# EAGLE design presTimer (EAGLE 7.7.0)
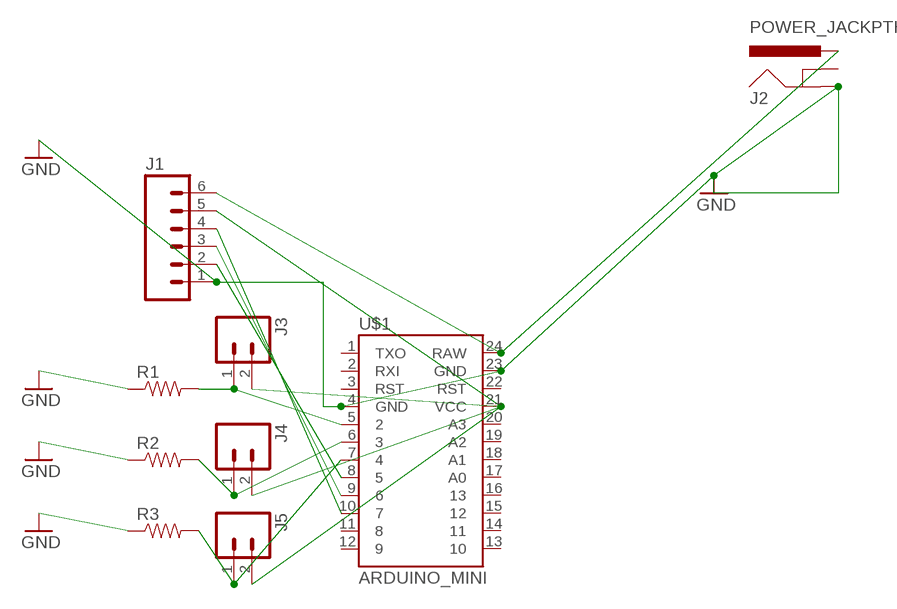
[diagram p0: schematic, sheet 1]

## Parts
J1  M06POLAR  [MOLEX-1X6]
J2  POWER_JACKPTH  [POWER_JACK_PTH]
J3  M02LOCK  [1X02_LOCK]
J4  M02LOCK  [1X02_LOCK]
J5  M02LOCK  [1X02_LOCK]
R1  RESISTORAXIAL-0.3  [AXIAL-0.3]
R2  RESISTORAXIAL-0.3  [AXIAL-0.3]
R3  RESISTORAXIAL-0.3  [AXIAL-0.3]
U$1  ARDUINO_MINI  [ARDUINO_MINI]

## Nets
GND: J1.1 J2.GND R1.P$1 R2.P$1 R3.P$1 U$1.4(GND) U$1.23(GND)
N$1: J1.2 U$1.8
N$2: J5.1 R3.P$2 U$1.7
N$3: J4.1 R2.P$2 U$1.6
N$4: J3.1 R1.P$2 U$1.5
N$5: J1.6 J2.PWR U$1.24(RAW)
N$6: J1.5 J3.2 J4.2 J5.2 U$1.21(VCC)
N$7: J1.3 U$1.9
N$8: J1.4 U$1.10
Unconnected: J2.GNDBREAK U$1.1(TXO) U$1.2(RXI) U$1.3(RST) U$1.11 U$1.12 U$1.13 U$1.14 U$1.15 U$1.16 U$1.17(A0) U$1.18(A1) U$1.19(A2) U$1.20(A3) U$1.22(RST)

## Library data of the parts
J1 = SparkFun-Connectors:M06: Header 6 Standard 6-pin 0.1" header. Use with straight break away headers (SKU : PRT-00116), right angle break away headers (PRT-00553), swiss pins (PRT-00743), machine pins (PRT-00117), and female headers (PRT-00115). Molex polarized connector foot print use with SKU : PRT-08094 with associated crimp pins and housings. NOTES ON THE VARIANTS LOCK and LOCK_LONGPADS... This footprint was designed to help hold the alignment of a through-hole component (i.e. 6-pin header) while soldering it into place. You may notice that each hole has been shifted either up or down by 0.005 of an inch from it's more standard position (which is a perfectly straight line). This slight alteration caused the pins (the squares in the middle) to touch the edges of the holes. Because they are alternating, it causes a "brace" to hold the component in place. 0.005 has proven to be the perfect amount of "off-center" position when using our standard breakaway headers. Although looks a little odd when you look at the bare footprint, once you have a header in there, the alteration is very hard to notice. Also,if you push a header all the way into place, it is covered up entirely on the bottom side. This idea of altering the position of holes to aid alignment will be further integrated into the Sparkfun Library for other footprints. It can help hold any component with 3 or more connection pins.
J2 = Spark:POWER_JACK: Power Jack This is the standard 5.5mm barrel jack for power. The PTH is the most common, proven, reliable, footprint. The Slot footprint only works if the mill layer is transmitted to the PCB fab house so be warned. Spark Fun Electronics SKU : PRT-00119 SMT: CONN-08106 Mating wall wart : TOL-00298 (and others)
J3-J5 = SparkFun-Connectors:M02: Standard 2-pin 0.1" header. Use with - straight break away headers ( PRT-00116) - right angle break away headers (PRT-00553) - swiss pins (PRT-00743) - machine pins (PRT-00117) - female headers (PRT-00115) Molex polarized connector foot print use with: PRT-08233 with associated crimp pins and housings. 2.54_SCREWTERM for use with PRT-10571. 3.5mm Screw Terminal footprints for PRT-08084 5mm Screw Terminal footprints for use with PRT-08432
R1-R3 = SparkFun-Passives:RESISTOR: Resistor Basic schematic elements and footprints for 0603, 1206, and PTH resistors.
U$1 = SparkFun-Boards:ARDUINO_MINI: Arduino Pro Mini footprint

## Board
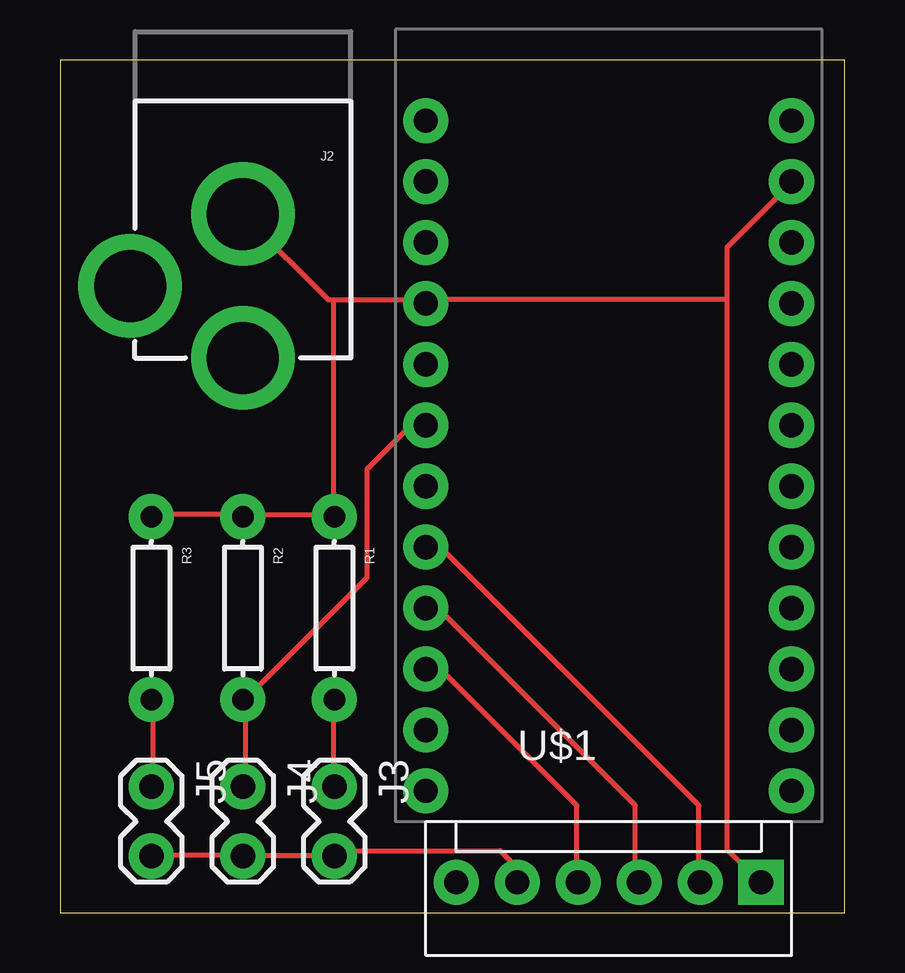
[diagram p1: board, top side]
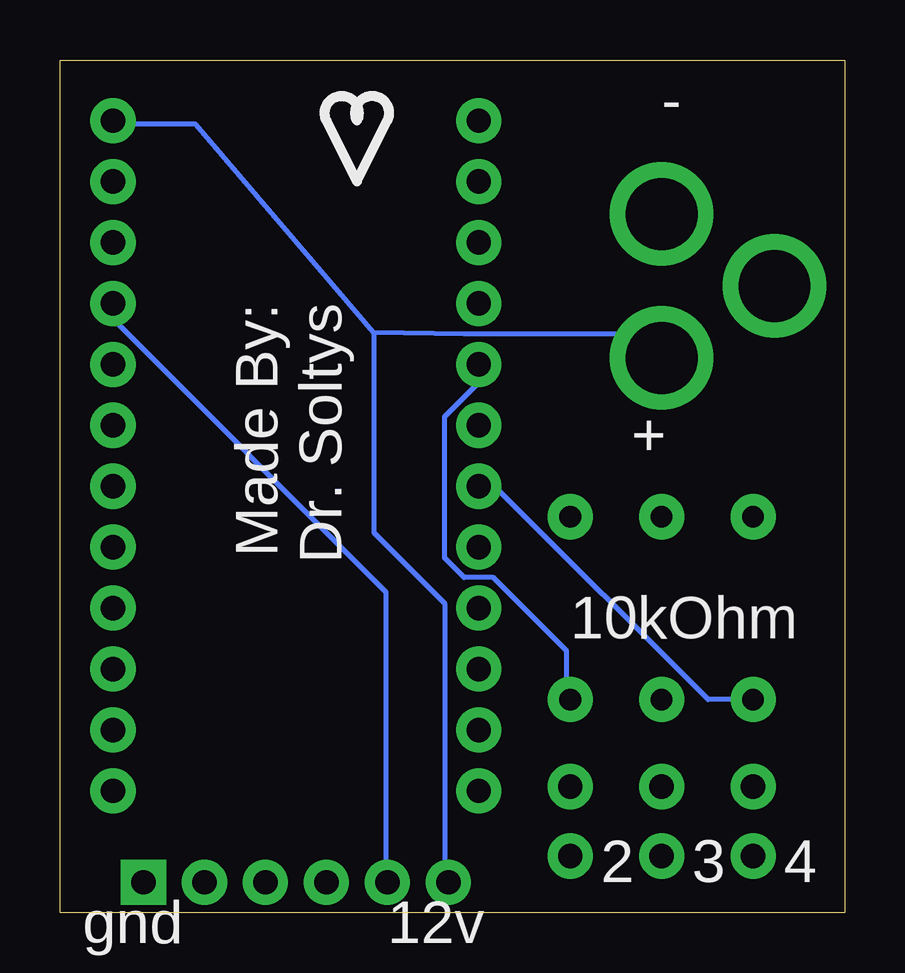
[diagram p2: board, bottom side, seen from below]

Size 32.69 x 35.55 mm. Coordinates in mm from the lower left corner, seen from the top.
Outline: 0,0 32.69,0 32.69,35.55 0,35.55 0,0
Copper layers (1*16): Top 0.035mm / dielectric 1.5mm / Bottom 0.035mm
Design rules "SparkFun": minimum track width 8mil, minimum drill 20mil, track to track 8mil, track to pad 8mil, pad to pad 8mil, via to via 8mil, smd to smd 8mil, copper to edge 8mil, drill to drill 8mil, minimum pad ring 12mil, minimum via ring 10mil, stop-mask expansion 4mil, vias tented up to drill 20mil, thermal gap 10mil

### Footprints (pad centres in the part's own frame; a part is rotated, then mirrored left to right if it is on the bottom)
MOLEX-1X6 = drill 1.016 pad 1.88 square: 1 0,0 | drill 1.016 pad 1.88: 2 2.54,0; 3 5.08,0; 4 7.62,0; 5 10.16,0; 6 12.7,0
POWER_JACK_PTH = drill 2.997 pad 4.318: GND 0,7.7; GNDBREAK 4.7,10.7; PWR 0,13.7
1X02_LOCK = drill 1.016 pad 1.88: 1 -0.178,0; 2 2.718,0
AXIAL-0.3 = drill 0.9 pad 1.88: P$1 -3.81,0; P$2 3.81,0
ARDUINO_MINI = drill 1.016 pad 1.88: 1 -7.62,12.7; 2 -7.62,10.16; 3 -7.62,7.62; 4 -7.62,5.08; 5 -7.62,2.54; 6 -7.62,0; 7 -7.62,-2.54; 8 -7.62,-5.08; 9 -7.62,-7.62; 10 -7.62,-10.16; 11 -7.62,-12.7; 12 -7.62,-15.24; 13 7.62,-15.24; 14 7.62,-12.7; 15 7.62,-10.16; 16 7.62,-7.62; 17 7.62,-5.08; 18 7.62,-2.54; 19 7.62,0; 20 7.62,2.54; 21 7.62,5.08; 22 7.62,7.62; 23 7.62,10.16; 24 7.62,12.7

### Placement (x,y rotation side)
J1  29.21,1.27 180 top
J2  7.62,36.83 180 top
J3  11.43,5.08 270 top
J4  7.62,5.08 270 top
J5  3.81,5.08 270 top
R1  11.43,12.7 270 top
R2  7.62,12.7 270 top
R3  3.81,12.7 270 top
U$1  22.86,20.32 0 top

### Tracks (layer width: path | path; a pad name or v marks a point on that pad's centre or on a via)
GND
  Top 0.203: R3.P$1 3.86,16.61 7.52,16.61 R2.P$1 7.72,16.61 11.38,16.61 | 11.38,25.55 11.18,25.55 7.72,29.01 J2.GND | 11.38,25.55 15.24,25.55 | 11.38,25.55 11.38,16.61 | 11.38,16.61 R1.P$1 | 27.79,25.55 27.79,27.74 30.48,30.43 U$1.23 | 27.79,25.55 27.79,2.64 J1.1 | 27.79,25.55 15.24,25.55 | 15.24,25.55 U$1.4
N$1
  Top 0.203: U$1.8 15.24,15.85 26.62,4.47 26.62,1.37 J1.2
N$2
  Top 0.203: J5.1 3.86,5.44 3.86,8.89 R3.P$2
  Bottom 0.203: R3.P$2 5.69,8.89 14.43,17.63 15.24,17.63 U$1.7
N$3
  Top 0.203: 7.72,8.89 7.72,5.44 J4.1 | U$1.6 15.24,20.93 12.8,18.49 12.8,13.97 7.72,8.89 | 7.72,8.89 R2.P$2
N$4
  Top 0.203: J3.1 11.38,5.44 11.38,8.89 R1.P$2
  Bottom 0.203: U$1.5 15.24,22.1 16.66,20.68 16.66,14.78 15.85,13.97 14.63,13.97 11.58,10.92 11.58,8.89 R1.P$2
N$5
  Bottom 0.203: 19.61,24.18 19.61,15.85 16.66,12.9 16.66,1.37 J1.6 | 19.61,24.18 15.85,24.13 8.53,24.13 7.72,23.32 J2.PWR | 19.61,24.18 27.03,32.87 30.48,32.87 U$1.24
N$6
  Top 0.203: J5.2 3.86,2.39 7.52,2.39 J4.2 7.72,2.39 11.38,2.39 J3.2 11.58,2.39 11.79,2.59 18.34,2.59 19.56,1.37 18.9,1.37 J1.5
  Bottom 0.203: U$1.21 30.48,24.74 19.1,13.36 19.1,1.37 J1.5
N$7
  Top 0.203: U$1.9 15.24,13.21 23.98,4.47 23.98,1.37 J1.3
N$8
  Top 0.203: U$1.10 15.24,10.77 21.54,4.47 21.54,1.37 J1.4

### Text on the board
bPlace: - | Made By: / Dr. Soltys | + | 10kOhm | 4 | 3 | 2 | 12v | gnd